# EAGLE design Bare_Bones_Programming_Shield (EAGLE 9.7.0)
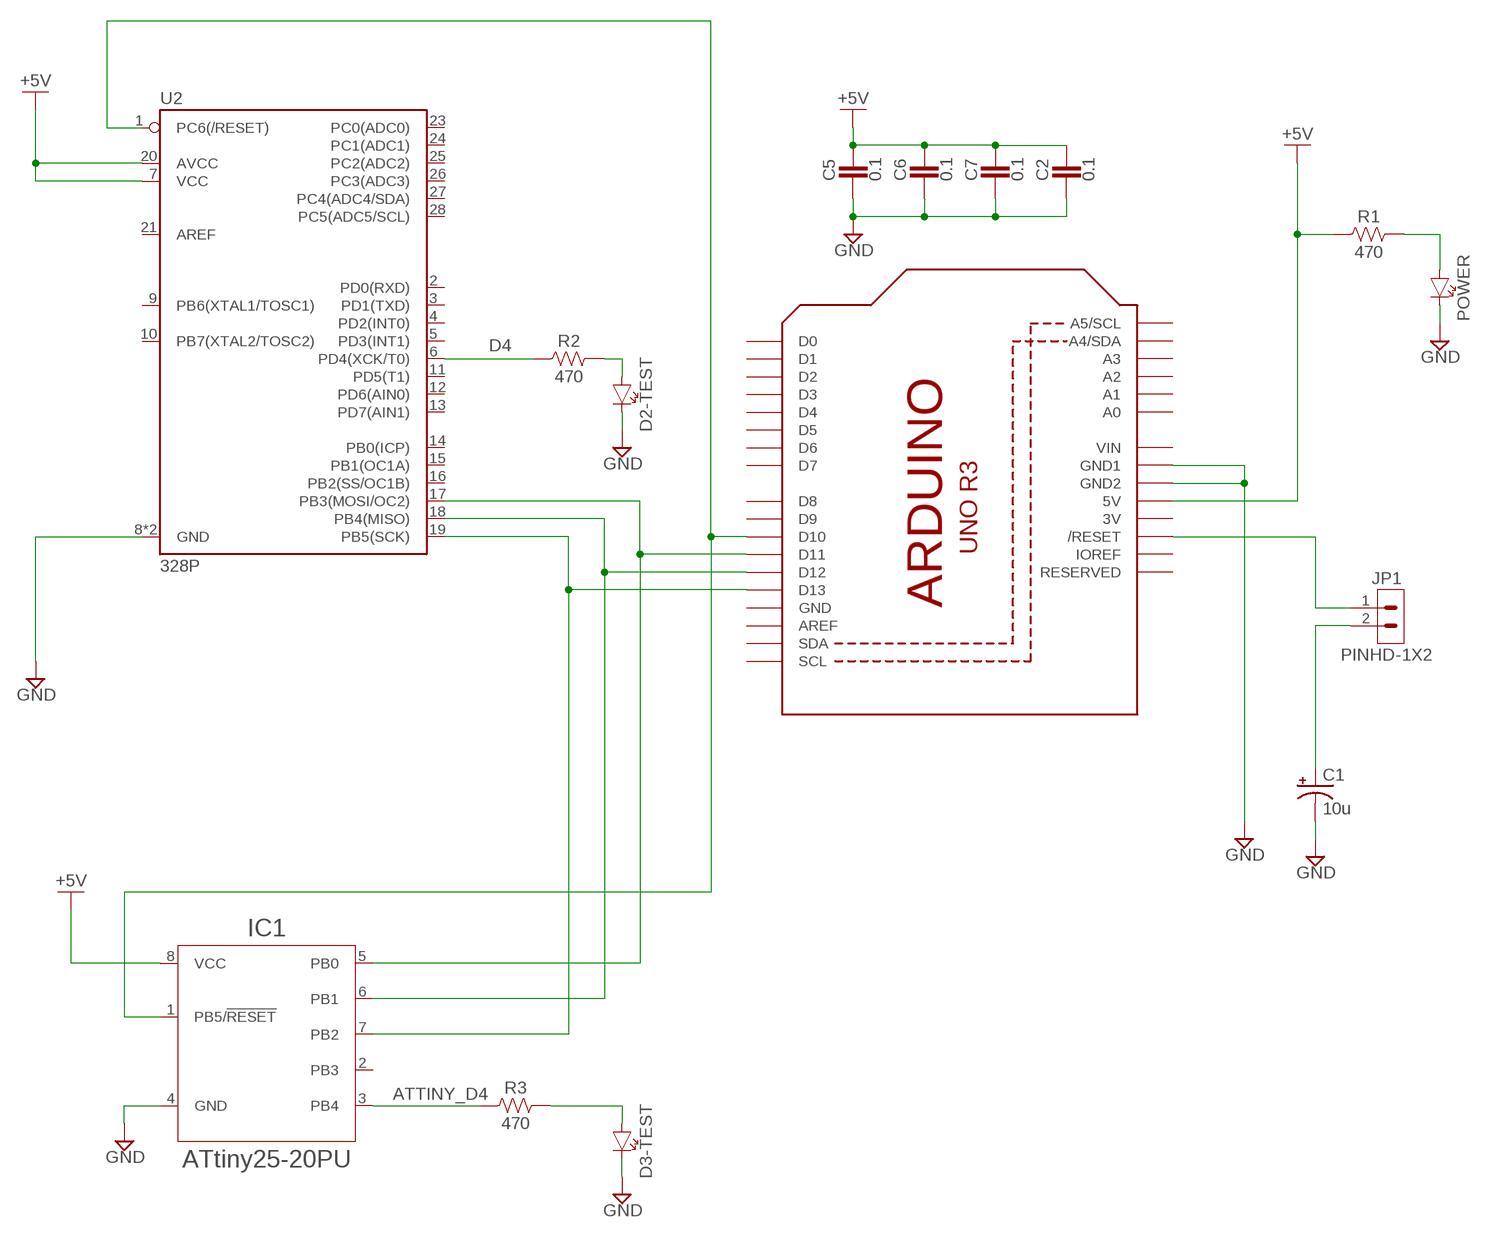
[diagram p0: schematic, sheet 1]

## Parts
C1  10u  CPOL-USE2-5  [E2-5]
C2  0.1  CAPACITORCERAMIC-2.54MM  [CAP-THRU-2.54MM]
C5  0.1  CAPACITORCERAMIC-2.54MM  [CAP-THRU-2.54MM]
C6  0.1  CAPACITORCERAMIC-2.54MM  [CAP-THRU-2.54MM]
C7  0.1  CAPACITORCERAMIC-2.54MM  [CAP-THRU-2.54MM]
D2-TEST  LED_RADIALRED  [LEDRD254W60D565H860B_R]
D3-TEST  LED_RADIALRED  [LEDRD254W60D565H860B_R]
IC1  ATtiny25-20PU  ATTINY25-20PU-8P_PDIP  [DIP787W55P254L958H533Q8B-8P3]
JP1  PINHD-1X2  [1X02]
POWER  LED_RADIALRED  [LEDRD254W60D565H860B_R]
R1  470  R-US_AXIAL-11.7MM-PITCH  [RESAD1176W63L850D250B]
R2  470  R-US_AXIAL-11.7MM-PITCH  [RESAD1176W63L850D250B]
R3  470  R-US_AXIAL-11.7MM-PITCH  [RESAD1176W63L850D250B]
U1  ARDUINOR3-DIMENSION  [ARDUINOR3]
U2  328P  ATMEGA328P_PDIP  [DIP28]

## Nets
+5V: C2.1 C5.1 C6.1 C7.1 IC1.8(VCC) R1.1 U1.5V U2.7(VCC) U2.20(AVCC)
ATTINY_D4: IC1.3(PB4) R3.1
D4: R2.1 U2.6(PD4(XCK/T0))
GND: C1.- C2.2 C5.2 C6.2 C7.2 D2-TEST.C D3-TEST.C IC1.4(GND) POWER.C U1.GND1 U1.GND2 U2.8(GND) U2.22(GND)
N$1: POWER.A R1.2
N$2: JP1.1 U1.RESET(/RESET)
N$3: C1.+ JP1.2
N$4: IC1.1(PB5/!RESET!) U1.D10 U2.1(PC6(/RESET))
N$5: IC1.5(PB0) U1.D11 U2.17(PB3(MOSI/OC2))
N$6: IC1.6(PB1) U1.D12 U2.18(PB4(MISO))
N$7: IC1.7(PB2) U1.D13 U2.19(PB5(SCK))
N$9: D3-TEST.A R3.2
N$10: D2-TEST.A R2.2
Unconnected: IC1.2(PB3) U1.A0 U1.A1 U1.A2 U1.A3 U1.A4(A4/SDA) U1.A5(A5/SCL) U1.AREF U1.D0 U1.D1 U1.D2 U1.D3 U1.D4 U1.D5 U1.D6 U1.D7 U1.D8 U1.D9 U1.IOREF U1.RESERVED U1.SCL U1.SDA U2.2(PD0(RXD)) U2.3(PD1(TXD)) U2.4(PD2(INT0)) U2.5(PD3(INT1)) U2.9(PB6(XTAL1/TOSC1)) U2.10(PB7(XTAL2/TOSC2)) U2.11(PD5(T1)) U2.12(PD6(AIN0)) U2.13(PD7(AIN1)) U2.14(PB0(ICP)) U2.15(PB1(OC1A)) U2.16(PB2(SS/OC1B)) U2.21(AREF) U2.23(PC0(ADC0)) U2.24(PC1(ADC1)) U2.25(PC2(ADC2)) U2.26(PC3(ADC3)) U2.27(PC4(ADC4/SDA)) U2.28(PC5(ADC5/SCL))

## Power pins joined to a net without a drawn wire
3V: U1.3V
GND: U1.GND
VIN: U1.VIN

## Library data of the parts
C1 = adafruit:CPOL-US: POLARIZED CAPACITOR, American symbol
C2 C5-C7 = Tinkercad:CAPACITOR: Capacitor - Generic
D2-TEST D3-TEST POWER = Opto-Electronic:LED_RADIAL: LED - Generic
IC1 = Tinkercad:ATTINY*-8P: Atmel tiny25/45/85, 8-bit AVR Microcontroller with 2/4/8K Bytes In-System Programmable Flash Datasheet <https://ww1.microchip.com/downloads/en/DeviceDoc/Atmel-2586-AVR-8-bit-Microcontroller-ATtiny25-ATtiny45-ATtiny85_Datasheet.pdf>
JP1 = Connector:PINHD-1X2: Pin Header
R1-R3 = Resistor:R-US: Resistor Fixed - ANSI
U1 = adafruit:ARDUINOR3: This is a new object for the new Arduino R3 - with extra pins that you may want to use (such as IOref, and duplicated A4/A5
U2 = SparkFun-IC-Microcontroller:ATMEGA328P_PDIP: Atmel 328P Through hole ATMEGA328P uC used in the Arduino 32kb flash, 1k EEPROM, 2k SRAM Datasheet <http://www.sparkfun.com/datasheets/Components/SMD/ATMega328.pdf> SparkFun Products Storefront component: AVR 28 Pin 20MHz 32K 6A/D - ATMega328P <https://www.sparkfun.com/products/9061> (COM-09061) SparkFun Simon Says - Through-Hole Soldering Kit <https://www.sparkfun.com/products/10547> (KIT-10547) SparkFun Learn to Solder - Simon Says <https://www.sparkfun.com/products/13708> (KIT-13708) SparkFun BigTime Watch Kit <https://www.sparkfun.com/products/11734> (KIT-11734) SparkFun ClockIt <https://www.sparkfun.com/products/10930> (KIT-10930) SparkFun Serial Enabled LCD Kit <https://www.sparkfun.com/products/10097> (LCD-10097) SparkFun Simon Tilts - Through Hole Soldering Kit <https://www.sparkfun.com/products/12634> (KIT-12634) SparkFun Frequency Counter Kit <https://www.sparkfun.com/products/10140> (KIT-10140) FabFM Radio Kit <https://www.sparkfun.com/products/11043> (KIT-11043) SparkFun Binary Blaster Kit <https://www.sparkfun.com/products/12037> (KIT-12037) SparkFun Metro-Gnome <https://www.sparkfun.com/products/9236> (KIT-09236) ATmega328 with Arduino Optiboot (Uno) <https://www.sparkfun.com/products/10524> (DEV-10524)

## Board
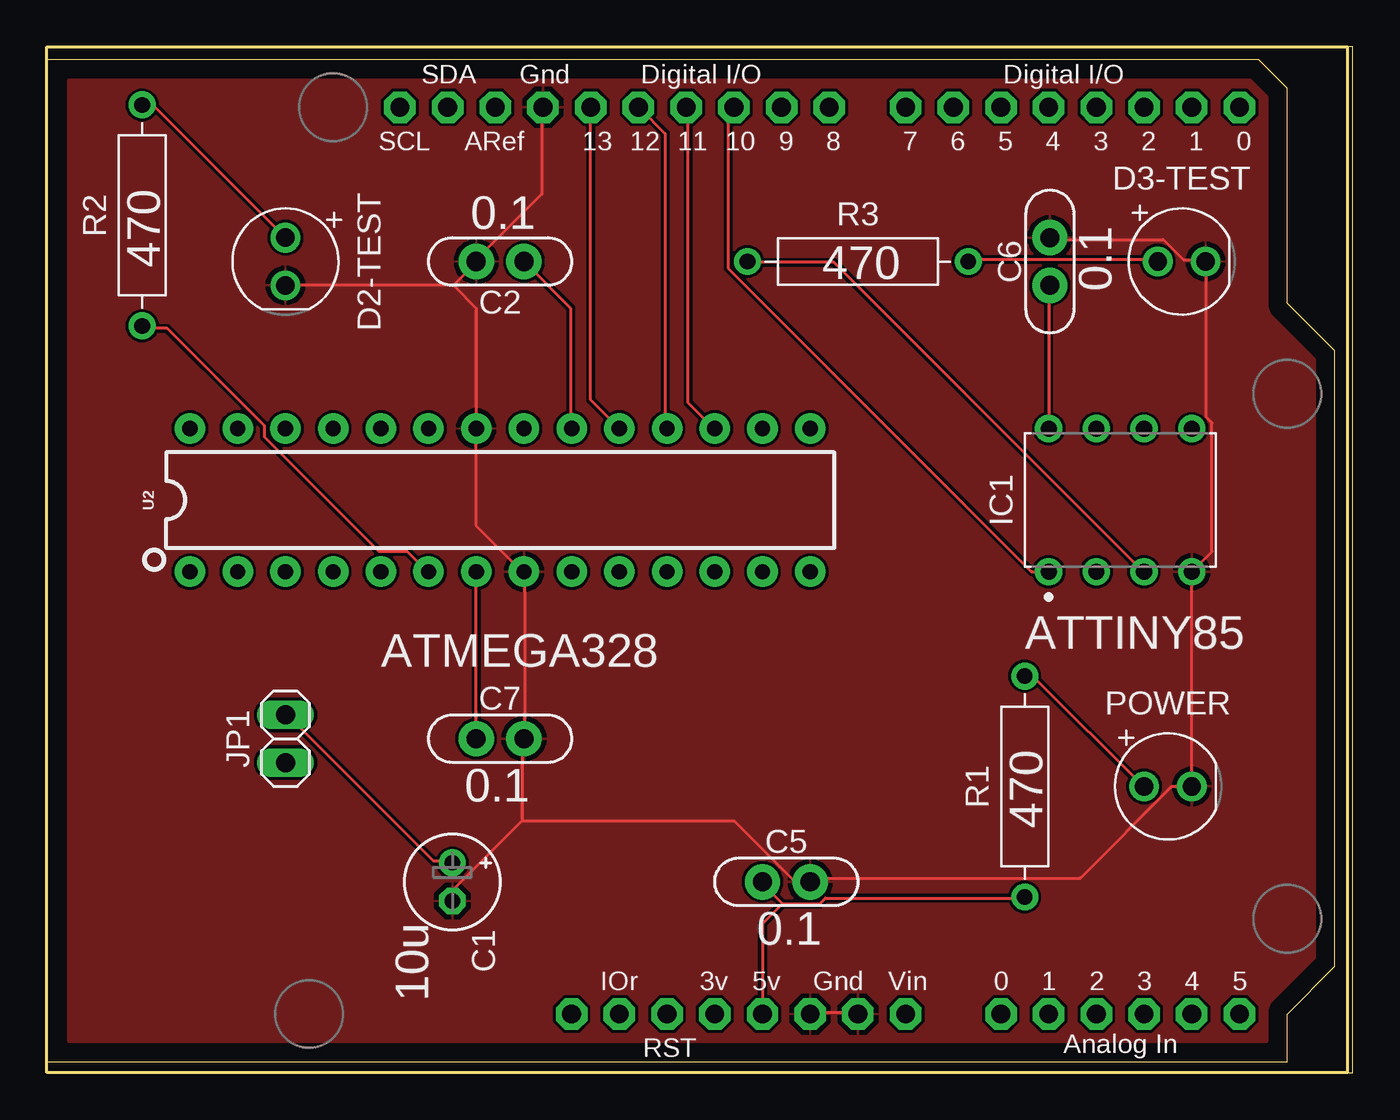
[diagram p1: board, top side]
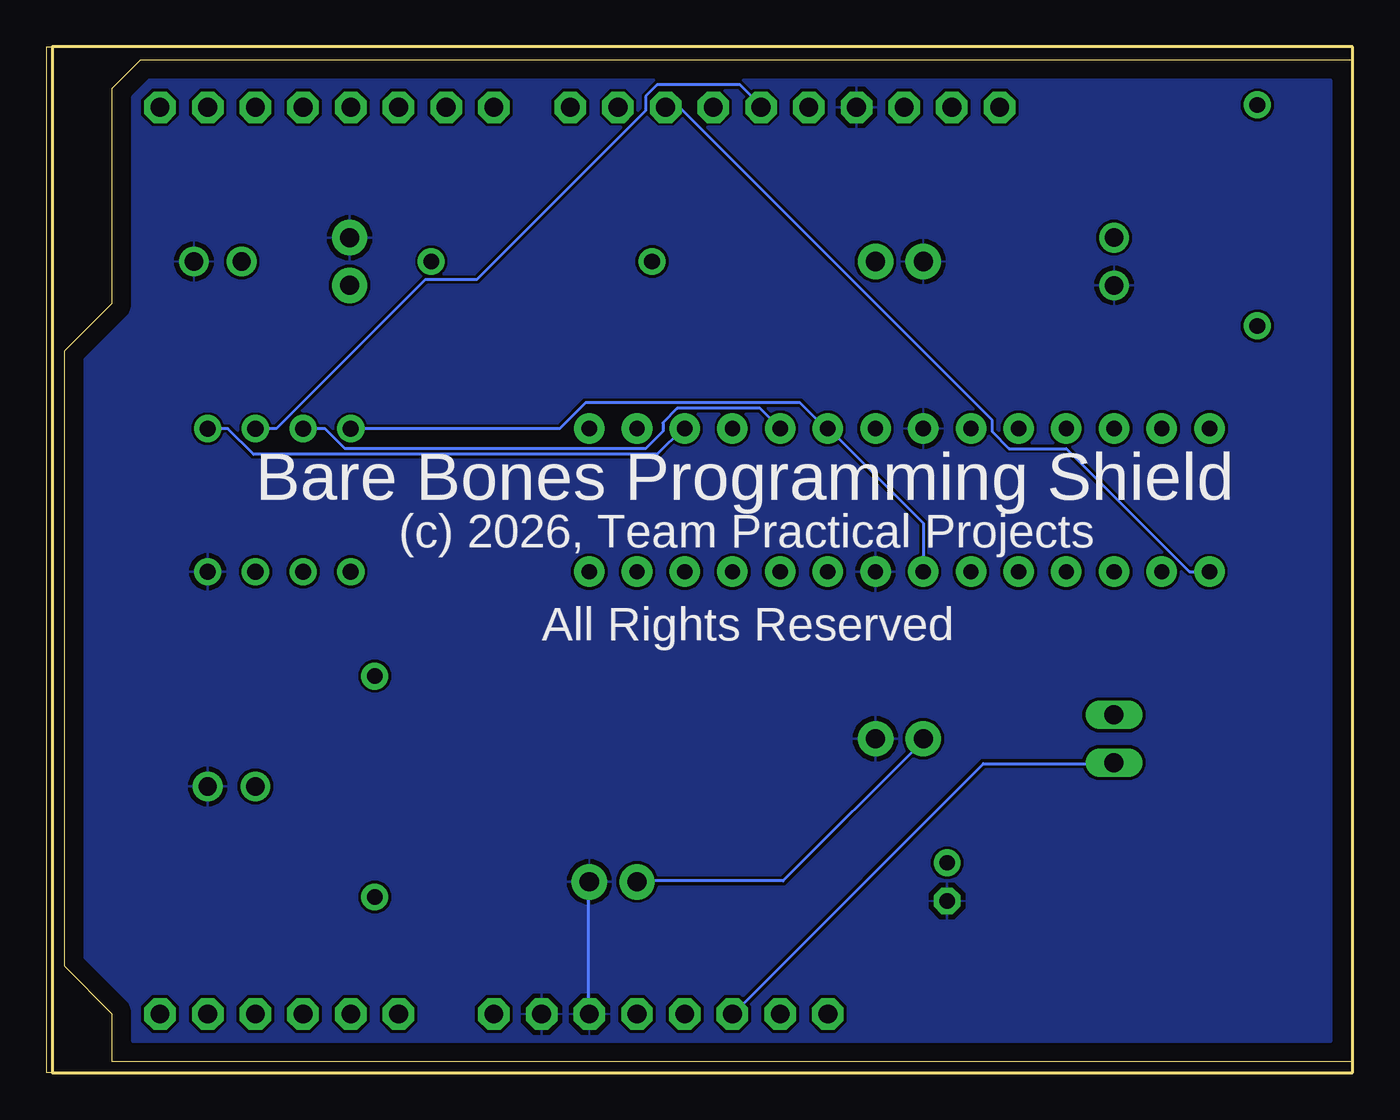
[diagram p2: board, bottom side, seen from below]

Size 69.52 x 54.6 mm. Coordinates in mm from the lower left corner, seen from the top.
Outline: 0,0 69.25,0
Outline: 69.25,0 69.52,0 69.52,54.6 69.25,54.6
Outline: 69.25,54.6 0,54.6
Outline: 0,54.6 0,0
Outline: 0,0 0,54.6
Outline: 0,54.6 69.25,54.6
Outline: 69.25,54.6 69.25,0
Outline: 69.25,0 0,0
Copper layers (1*16): Top / Bottom
Stack-up Default Layer Stack: Top SilkScreen Epoxy Ink / Top SolderMask SR:Green 0.0254mm Dk 4.3 / Top Surface Finish Lead-Free 0.02mm / Top CuFoil:007 0.035mm / Dielectric-1 User Defined 1.5mm / Bottom CuFoil:007 0.035mm / Bottom Surface Finish Lead-Free 0.02mm / Bottom SolderMask SR:Green 0.0254mm Dk 4.3 / Bottom SilkScreen Epoxy Ink
Design rules: minimum copper width 6mil, minimum drill size 0.35mm, copper clearance wire_polygon to wire_polygon 6mil, copper clearance wire_polygon to pad_smd 6mil, copper clearance wire_polygon to via 6mil, copper clearance pad_smd to pad_smd 6mil, copper clearance pad_smd to via 6mil, copper clearance via to via 6mil, copper clearance smd to pad (same net) 6mil, copper clearance smd to via (same net) 6mil, copper clearance smd to smd (same net) 6mil, dimension clearance 40mil, via restrict clearance 0mil, restrict clearance 0mil, drill distance 6mil, keepout clearance 0mil

### Footprints (pad centres in the part's own frame; a part is rotated, then mirrored left to right if it is on the bottom)
E2-5 = drill 0.813 pad 1.422: + -1.016,0 | drill 0.813 pad 1.422 octagon: - 1.016,0
CAP-THRU-2.54MM = drill 1.016 pad 1.88: 1 -1.27,0; 2 1.27,0
LEDRD254W60D565H860B_R = drill 0.981 pad 1.581: A -1.27,0; C 1.27,0
DIP787W55P254L958H533Q8B-8P3 = drill 0.852 pad 1.452: 1 -3.81,3.81; 2 -3.81,1.27; 3 -3.81,-1.27; 4 -3.81,-3.81; 5 3.81,-3.81; 6 3.81,-1.27; 7 3.81,1.27; 8 3.81,3.81
1X02 = drill 1.016 long: 1 -1.27,0; 2 1.27,0
RESAD1176W63L850D250B = drill 0.83 pad 1.43: 1 -5.88,0; 2 5.88,0
ARDUINOR3 = drill 1 pad 1.676 octagon: 3V 35.56,2.54; 5V 38.1,2.54; A0 50.8,2.54; A1 53.34,2.54; A2 55.88,2.54; A3 58.42,2.54; A4 60.96,2.54; A5 63.5,2.54; AREF 23.876,50.8; D0 63.5,50.8; D1 60.96,50.8; D2 58.42,50.8; D3 55.88,50.8; D4 53.34,50.8; D5 50.8,50.8; D6 48.26,50.8; D7 45.72,50.8; D8 41.656,50.8; D9 39.116,50.8; D10 36.576,50.8; D11 34.036,50.8; D12 31.496,50.8; D13 28.956,50.8; GND 26.416,50.8; GND1 43.18,2.54; GND2 40.64,2.54; IOREF 30.48,2.54; RESERVED 27.94,2.54; RESET 33.02,2.54; SCL 18.796,50.8; SDA 21.336,50.8; VIN 45.72,2.54
DIP28 = drill 0.813 pad 1.626: 1 -16.51,-3.81; 2 -13.97,-3.81; 3 -11.43,-3.81; 4 -8.89,-3.81; 5 -6.35,-3.81; 6 -3.81,-3.81; 7 -1.27,-3.81; 8 1.27,-3.81; 9 3.81,-3.81; 10 6.35,-3.81; 11 8.89,-3.81; 12 11.43,-3.81; 13 13.97,-3.81; 14 16.51,-3.81; 15 16.51,3.81; 16 13.97,3.81; 17 11.43,3.81; 18 8.89,3.81; 19 6.35,3.81; 20 3.81,3.81; 21 1.27,3.81; 22 -1.27,3.81; 23 -3.81,3.81; 24 -6.35,3.81; 25 -8.89,3.81; 26 -11.43,3.81; 27 -13.97,3.81; 28 -16.51,3.81

### Placement (x,y rotation side)
C1  21.59,10.16 270 top
C2  24.13,43.18 180 top
C5  39.37,10.16 0 top
C6  53.41,43.18 90 top
C7  24.13,17.78 0 top
D2-TEST  12.7,43.18 270 top
D3-TEST  60.42,43.18 0 top
IC1  57.15,30.48 90 top
JP1  12.7,17.78 90 top
POWER  59.69,15.24 0 top
R1  52.06,15.23 90 top
R2  5.07,45.64 90 top
R3  43.18,43.18 0 top
U1  0,0.58 0 top
U2  24.13,30.48 0 top

### Tracks (layer width: path | path; a pad name or v marks a point on that pad's centre or on a via)
+5V
  Top 0.152: 39.17,8.99 41.15,8.99 41.45,9.3 51.97,9.3 R1.1 | 39.17,8.99 38.1,10.06 C5.1 | 39.17,8.99 38.1,7.92 38.1,3.2 U1.5V | U2.7 22.86,17.83 C7.1 | IC1.8 53.34,41.91 C6.1 | U2.20 27.89,34.29 27.89,40.69 25.45,43.13 C2.1
  Bottom 0.152: IC1.8 42.22,34.29 40.84,35.66 29.41,35.66 28.04,34.29 U2.20 27.89,34.29 22.86,29.26 U2.7 | C5.1 38.1,10.21 30.33,10.21 22.86,17.68 C7.1
ATTINY_D4
  Top 0.152: R3.1 37.34,43.13 41.91,43.13 58.37,26.67 IC1.3
D4
  Top 0.152: R2.1 5.18,39.62 6.4,39.62 11.58,34.44 11.58,33.83 17.68,27.74 19.2,27.74 20.27,26.67 U2.6
GND
  Top 0.152: C6.2 53.49,44.35 59.44,44.35 60.5,43.28 61.57,43.28 D3-TEST.C 61.72,43.13 61.72,34.9 62.03,34.59 62.03,27.74 IC1.4 POWER.C 59.89,15.24 55.02,10.36 40.84,10.36 40.69,10.21 C5.2 40.54,10.21 39.78,10.21 36.58,13.41 25.3,13.41 | 21.64,41.91 12.8,41.91 D2-TEST.C | 21.64,41.91 22.86,43.13 C2.2 22.86,43.28 26.36,46.79 26.36,51.36 U1.GND | 21.64,41.91 22.86,40.69 U2.22 22.86,29.11 25.3,26.67 U2.8 25.45,26.67 25.45,17.83 C7.2 25.3,17.68 25.3,13.41 | U1.GND2 40.69,3.2 43.13,3.2 U1.GND1 | 25.3,13.41 21.64,9.75 21.64,9.14 C1.-
  Bottom 0.152: C5.2 40.69,10.06 40.69,3.2 U1.GND2
  pour Top: 0,0 0,55.88 71.12,55.88 68.58,55.88 68.58,0
  pour Bottom: 0,0 0,53.34 68.58,53.34 68.58,0
N$1
  Top 0.152: R1.2 52.12,21.03 52.58,21.03 58.37,15.24 POWER.A
N$2
  Bottom 0.152: JP1.1 12.8,16.46 19.66,16.46 32.92,3.2 U1.RESET
N$3
  Top 0.152: C1.+ 21.49,11.28 20.57,11.28 12.8,19.05 JP1.2
N$4
  Top 0.152: IC1.1 52.43,26.67 36.27,42.82 36.27,51.05 36.58,51.36 U1.D10
  Bottom 0.152: U2.1 8.69,26.67 15.24,33.22 18.29,33.22 19.2,34.14 19.2,34.75 35.81,51.36 36.58,51.36 U1.D10
N$5
  Top 0.152: U1.D11 34.14,51.36 34.14,35.66 35.51,34.29 U2.17
  Bottom 0.152: IC1.5 59.89,34.29 58.52,32.92 37.03,32.92 35.66,34.29 U2.17
N$6
  Top 0.152: U2.18 32.92,34.29 32.92,49.99 31.55,51.36 U1.D12
  Bottom 0.152: IC1.6 58.37,34.29 57.3,34.29 49.38,42.22 46.63,42.22 37.64,51.21 37.64,51.97 37.03,52.58 32.61,52.58 31.55,51.51 U1.D12
N$7
  Top 0.152: U2.19 28.96,35.81 28.96,51.36 U1.D13
  Bottom 0.152: U2.19 31.55,35.36 35.97,35.36 36.73,34.59 36.73,34.14 37.64,33.22 53.65,33.22 54.71,34.29 55.78,34.29 IC1.7
N$9
  Top 0.152: R3.2 49.07,43.28 59.13,43.28 D3-TEST.A
N$10
  Top 0.152: R2.2 5.18,51.51 5.64,51.51 12.65,44.5 D2-TEST.A

### Text on the board
SilkscreenTop: 470 | 0.1 | 470 | 0.1 | ATTINY85 | ATMEGA328 | 470 | 0.1 | 10u | 0.1
SilkscreenBottom: Bare Bones Programming Shield | (c) 2026, Team Practical Projects | All Rights Reserved